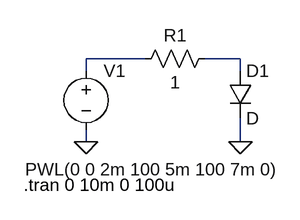
[diagram p0: schematic Diode.asc]
Diode.asc, the LTspice schematic file:
Version 4
SHEET 1 880 680
WIRE 224 128 144 128
WIRE 352 128 304 128
WIRE 144 144 144 128
WIRE 352 144 352 128
WIRE 144 240 144 224
WIRE 352 240 352 208
FLAG 144 240 0
FLAG 352 240 0
SYMBOL voltage 144 128 R0
WINDOW 3 -82 149 Left 2
WINDOW 123 0 0 Left 0
WINDOW 39 0 0 Left 0
SYMATTR InstName V1
SYMATTR Value PWL(0 0 2m 100 5m 100 7m 0)
SYMBOL res 320 112 R90
WINDOW 0 0 56 VBottom 2
WINDOW 3 32 56 VTop 2
SYMATTR InstName R1
SYMATTR Value 1
SYMBOL diode 336 144 R0
SYMATTR InstName D1
TEXT 60 298 Left 2 !.tran 0 10m 0 100u

The netlist it stands for:
* Diode.asc
V1 N001 0 PWL(0 0 2m 100 5m 100 7m 0)
R1 N002 N001 1
D1 N002 0 D
.model D D
.lib standard.dio
.tran 0 10m 0 100u
.backanno
.end